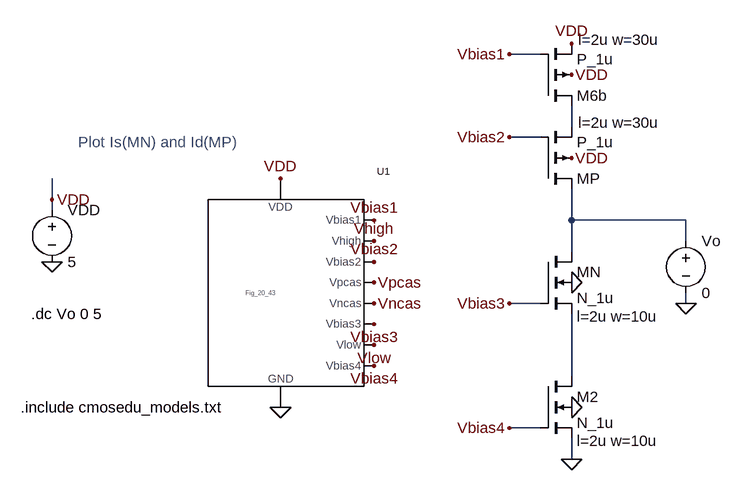
[diagram p0: schematic Fig20_44.asc]
Fig20_44.asc, the LTspice schematic file:
Version 4
SHEET 1 1580 680
WIRE 1200 -432 1152 -432
WIRE 1248 -320 1248 -352
WIRE 1200 -304 1152 -304
WIRE 448 -208 448 -240
WIRE 448 -192 448 -208
WIRE 1248 -176 1248 -224
WIRE 1424 -176 1248 -176
WIRE 1424 -144 1424 -176
WIRE 1248 -128 1248 -176
WIRE 1200 -48 1152 -48
WIRE 1424 -48 1424 -64
WIRE 1248 64 1248 -32
WIRE 1200 144 1152 144
WIRE 1248 192 1248 160
FLAG 448 -112 0
FLAG 448 -208 VDD
FLAG 1248 112 0
FLAG 1248 192 0
FLAG 1424 -48 0
FLAG 1248 -80 0
FLAG 1248 -448 VDD
FLAG 1248 -400 VDD
FLAG 1248 -272 VDD
FLAG 1152 -432 Vbias1
FLAG 1152 -304 Vbias2
FLAG 1152 -48 Vbias3
FLAG 1152 144 Vbias4
FLAG 800 -240 VDD
FLAG 800 112 0
FLAG 944 -176 Vbias1
FLAG 944 -144 Vhigh
FLAG 944 -112 Vbias2
FLAG 944 -16 Vbias3
FLAG 944 -80 Vpcas
FLAG 944 -48 Vncas
FLAG 944 48 Vbias4
FLAG 944 16 Vlow
SYMBOL voltage 448 -208 R0
WINDOW 123 0 0 Left 2
WINDOW 39 0 0 Left 2
SYMATTR InstName VDD
SYMATTR Value 5
SYMBOL nmos4 1200 64 R0
WINDOW 123 56 100 Left 2
SYMATTR Value2 l=2u w=10u
SYMATTR InstName M2
SYMATTR Value N_1u
SYMBOL voltage 1424 -160 R0
SYMATTR InstName Vo
SYMATTR Value 0
SYMBOL nmos4 1200 -128 R0
WINDOW 123 56 100 Left 2
SYMATTR Value2 l=2u w=10u
SYMATTR InstName MN
SYMATTR Value N_1u
SYMBOL pmos4 1200 -352 M180
WINDOW 123 58 102 Left 2
WINDOW 0 56 16 Left 2
SYMATTR Value2 l=2u w=30u
SYMATTR InstName M6b
SYMATTR Value P_1u
SYMBOL pmos4 1200 -224 M180
WINDOW 123 58 102 Left 2
WINDOW 0 56 16 Left 2
SYMATTR Value2 l=2u w=30u
SYMATTR InstName MP
SYMATTR Value P_1u
SYMBOL Fig_20_43 800 -64 R0
SYMATTR InstName U1
TEXT 400 112 Left 2 !.include cmosedu_models.txt
TEXT 488 -296 Left 2 ;Plot Is(MN) and Id(MP)
TEXT 416 -32 Left 2 !.dc Vo 0 5

The netlist it stands for:
* Fig20_44.asc
VDD VDD 0 5
M2 N003 Vbias4 0 0 N_1u l=2u w=10u
Vo N002 0 0
MN N002 Vbias3 N003 0 N_1u l=2u w=10u
M6b N001 Vbias1 VDD VDD P_1u l=2u w=30u
MP N002 Vbias2 N001 VDD P_1u l=2u w=30u
XU1 Vbias1 Vhigh Vbias2 Vpcas Vncas Vbias3 Vlow Vbias4 VDD 0 Fig_20_43  ; pins Vbias1 Vhigh Vbias2 Vpcas Vncas Vbias3 Vlow Vbias4 VDD GND
.model NMOS NMOS
.model PMOS PMOS
.lib standard.mos
.include cmosedu_models.txt
* Plot Is(MN) and Id(MP)
.dc Vo 0 5
.backanno
.end